# EAGLE schematic serboRGB (EAGLE 7.2.0)
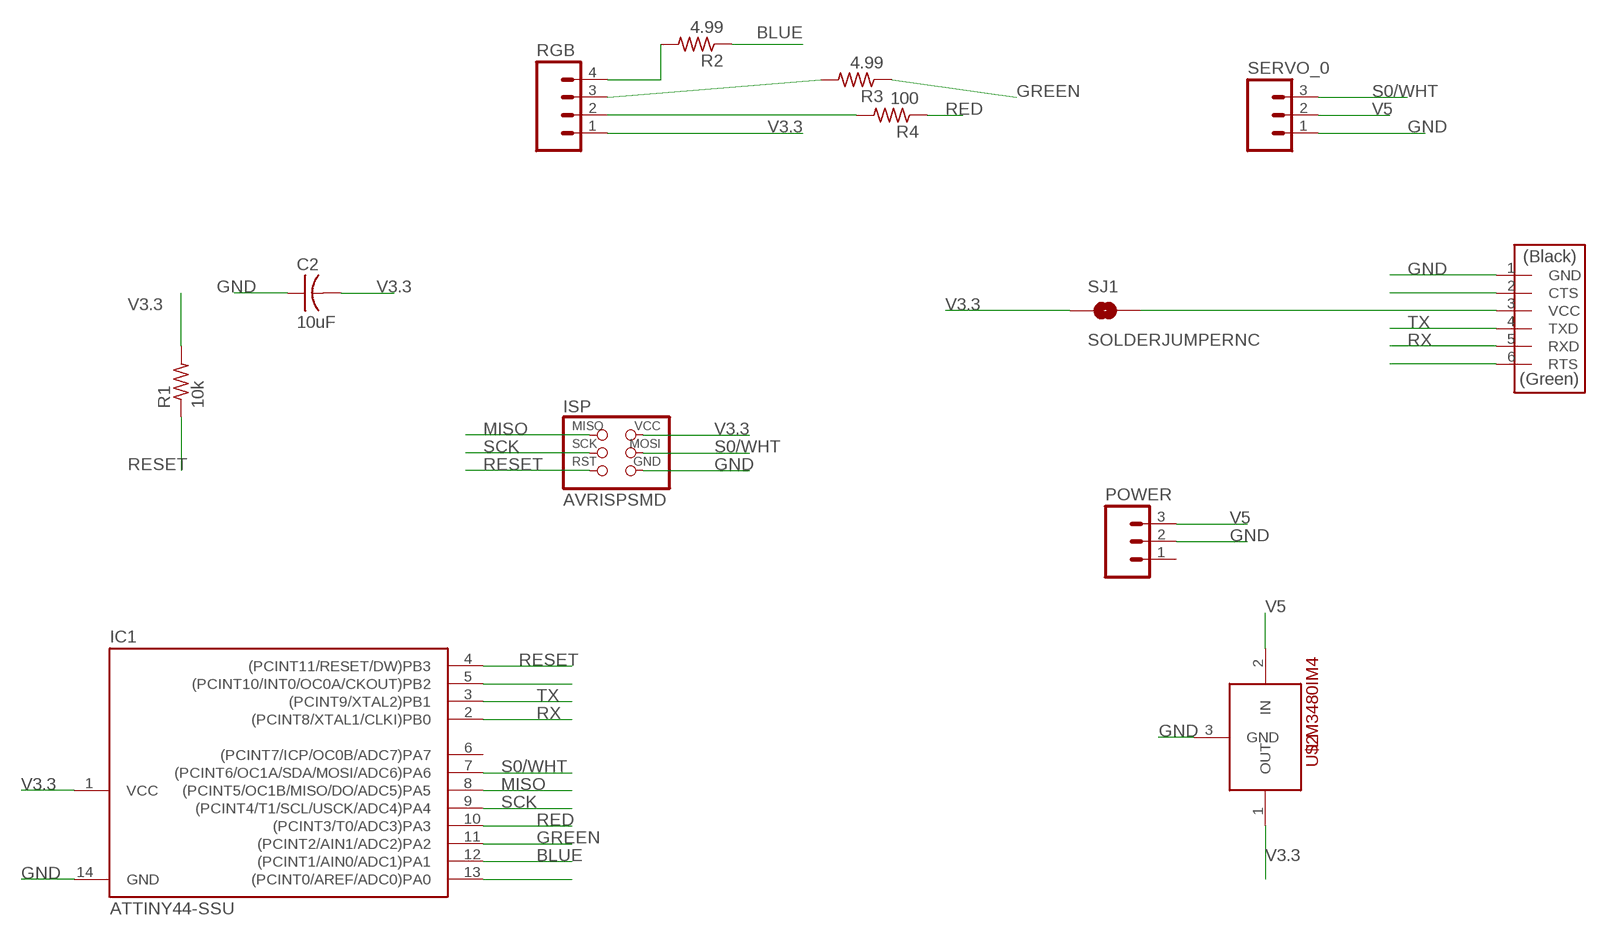
[diagram p0: schematic, sheet 1]

## Parts
C2  10uF  CAP-US1206FAB  [C1206FAB]
IC1  ATTINY44-SSU  [SOIC14]
ISP  AVRISPSMD  [2X03SMD]
POWER  M03SMD_RA_MALE_POST  [1X03_SMD_RA_MALE_POST]
R1  10k  RESISTOR1206  [1206]
R2  4.99  RESISTOR1206  [1206]
R3  4.99  RESISTOR1206  [1206]
R4  100  RESISTOR1206  [1206]
RGB  M04SMD  [1X04-SMD]
SERVO_0  M03SMD_RA_MALE_POST  [1X03_SMD_RA_MALE_POST]
SJ1  SOLDERJUMPERNC  [SJ_2S]
U$1  FTDI-SMD-HEADER  [1X06SMD]
U$2  LM3480IM4  [SOT23-3]

## Nets
BLUE: IC1.12((PCINT1/AIN0/ADC1)PA1) R2.1
GND: C2.1 IC1.14(GND) ISP.6(GND) POWER.2 SERVO_0.1 U$1.1(GND) U$2.3(GND)
GREEN: IC1.11((PCINT2/AIN1/ADC2)PA2) R3.1
MISO: IC1.8((PCINT5/OC1B/MISO/DO/ADC5)PA5) ISP.1(MISO)
N$1: R4.2 RGB.2
N$2: IC1.5((PCINT10/INT0/OC0A/CKOUT)PB2)
N$3: R3.2 RGB.3
N$4: R2.2 RGB.4
N$6: U$1.2(CTS)
N$7: SJ1.2 U$1.3(VCC)
N$10: U$1.6(RTS)
N$12: IC1.13((PCINT0/AREF/ADC0)PA0)
RED: IC1.10((PCINT3/T0/ADC3)PA3) R4.1
RESET: IC1.4((PCINT11/RESET/DW)PB3) ISP.5(RST) R1.1
RX: IC1.2((PCINT8/XTAL1/CLKI)PB0) U$1.5(RXD)
S0/WHT: IC1.7((PCINT6/OC1A/SDA/MOSI/ADC6)PA6) ISP.4(MOSI) SERVO_0.3
SCK: IC1.9((PCINT4/T1/SCL/USCK/ADC4)PA4) ISP.3(SCK)
TX: IC1.3((PCINT9/XTAL2)PB1) U$1.4(TXD)
V3.3: C2.2 IC1.1(VCC) ISP.2(VCC) R1.2 RGB.1 SJ1.1 U$2.1(OUT)
V5: POWER.3 SERVO_0.2 U$2.2(IN)
Unconnected: IC1.6((PCINT7/ICP/OC0B/ADC7)PA7) POWER.1

## Library data of the parts
C2 = fab:CAP-US
IC1 = 01_FAB_RHello:ATTINY44
ISP = 01_FAB_RHello:AVRISP
POWER SERVO_0 = SparkFun-Connectors:M03: Header 3 Standard 3-pin 0.1" header. Use with straight break away headers (SKU : PRT-00116), right angle break away headers (PRT-00553), swiss pins (PRT-00743), machine pins (PRT-00117), and female headers (PRT-00115). Molex polarized connector foot print use with SKU : PRT-08232 with associated crimp pins and housings.
R1-R4 = 01_FAB_RHello:RESISTOR
RGB = SparkFun-Connectors:M04: Header 4 Standard 4-pin 0.1" header. Use with straight break away headers (SKU : PRT-00116), right angle break away headers (PRT-00553), swiss pins (PRT-00743), machine pins (PRT-00117), and female headers (PRT-00115). Molex polarized connector foot print use with SKU : PRT-08231 with associated crimp pins and housings. 1MM SMD Version SKU: PRT-10208
SJ1 = SparkFun-Retired:SOLDERJUMPER: Solder Jumper Standard SMD solder jumper. Used to automate production. Two varients : Normally Open and Normally Closed are the same, but have different paste layers. NC will have a large amount of paste and should jumper during reflow.
U$1 = fab:FTDI-SMD-HEADER
U$2 = SparkFun-PowerIC:LM3480IM4: Small package linear regulator